# EasyEDA Pro project TES_Controller_V1.1.eprj

# Schematic Schematic1

## Sheets
1 P1: Board Name: Board1; Create Date: 2025-07-27; Page Name: P1; Project Name: TES_Controller_V1.1; Schematic Name: Schematic1; Update Date: 2025-08-24; Company: EasyEDA.com; Page Size: A4; Version: V1.0
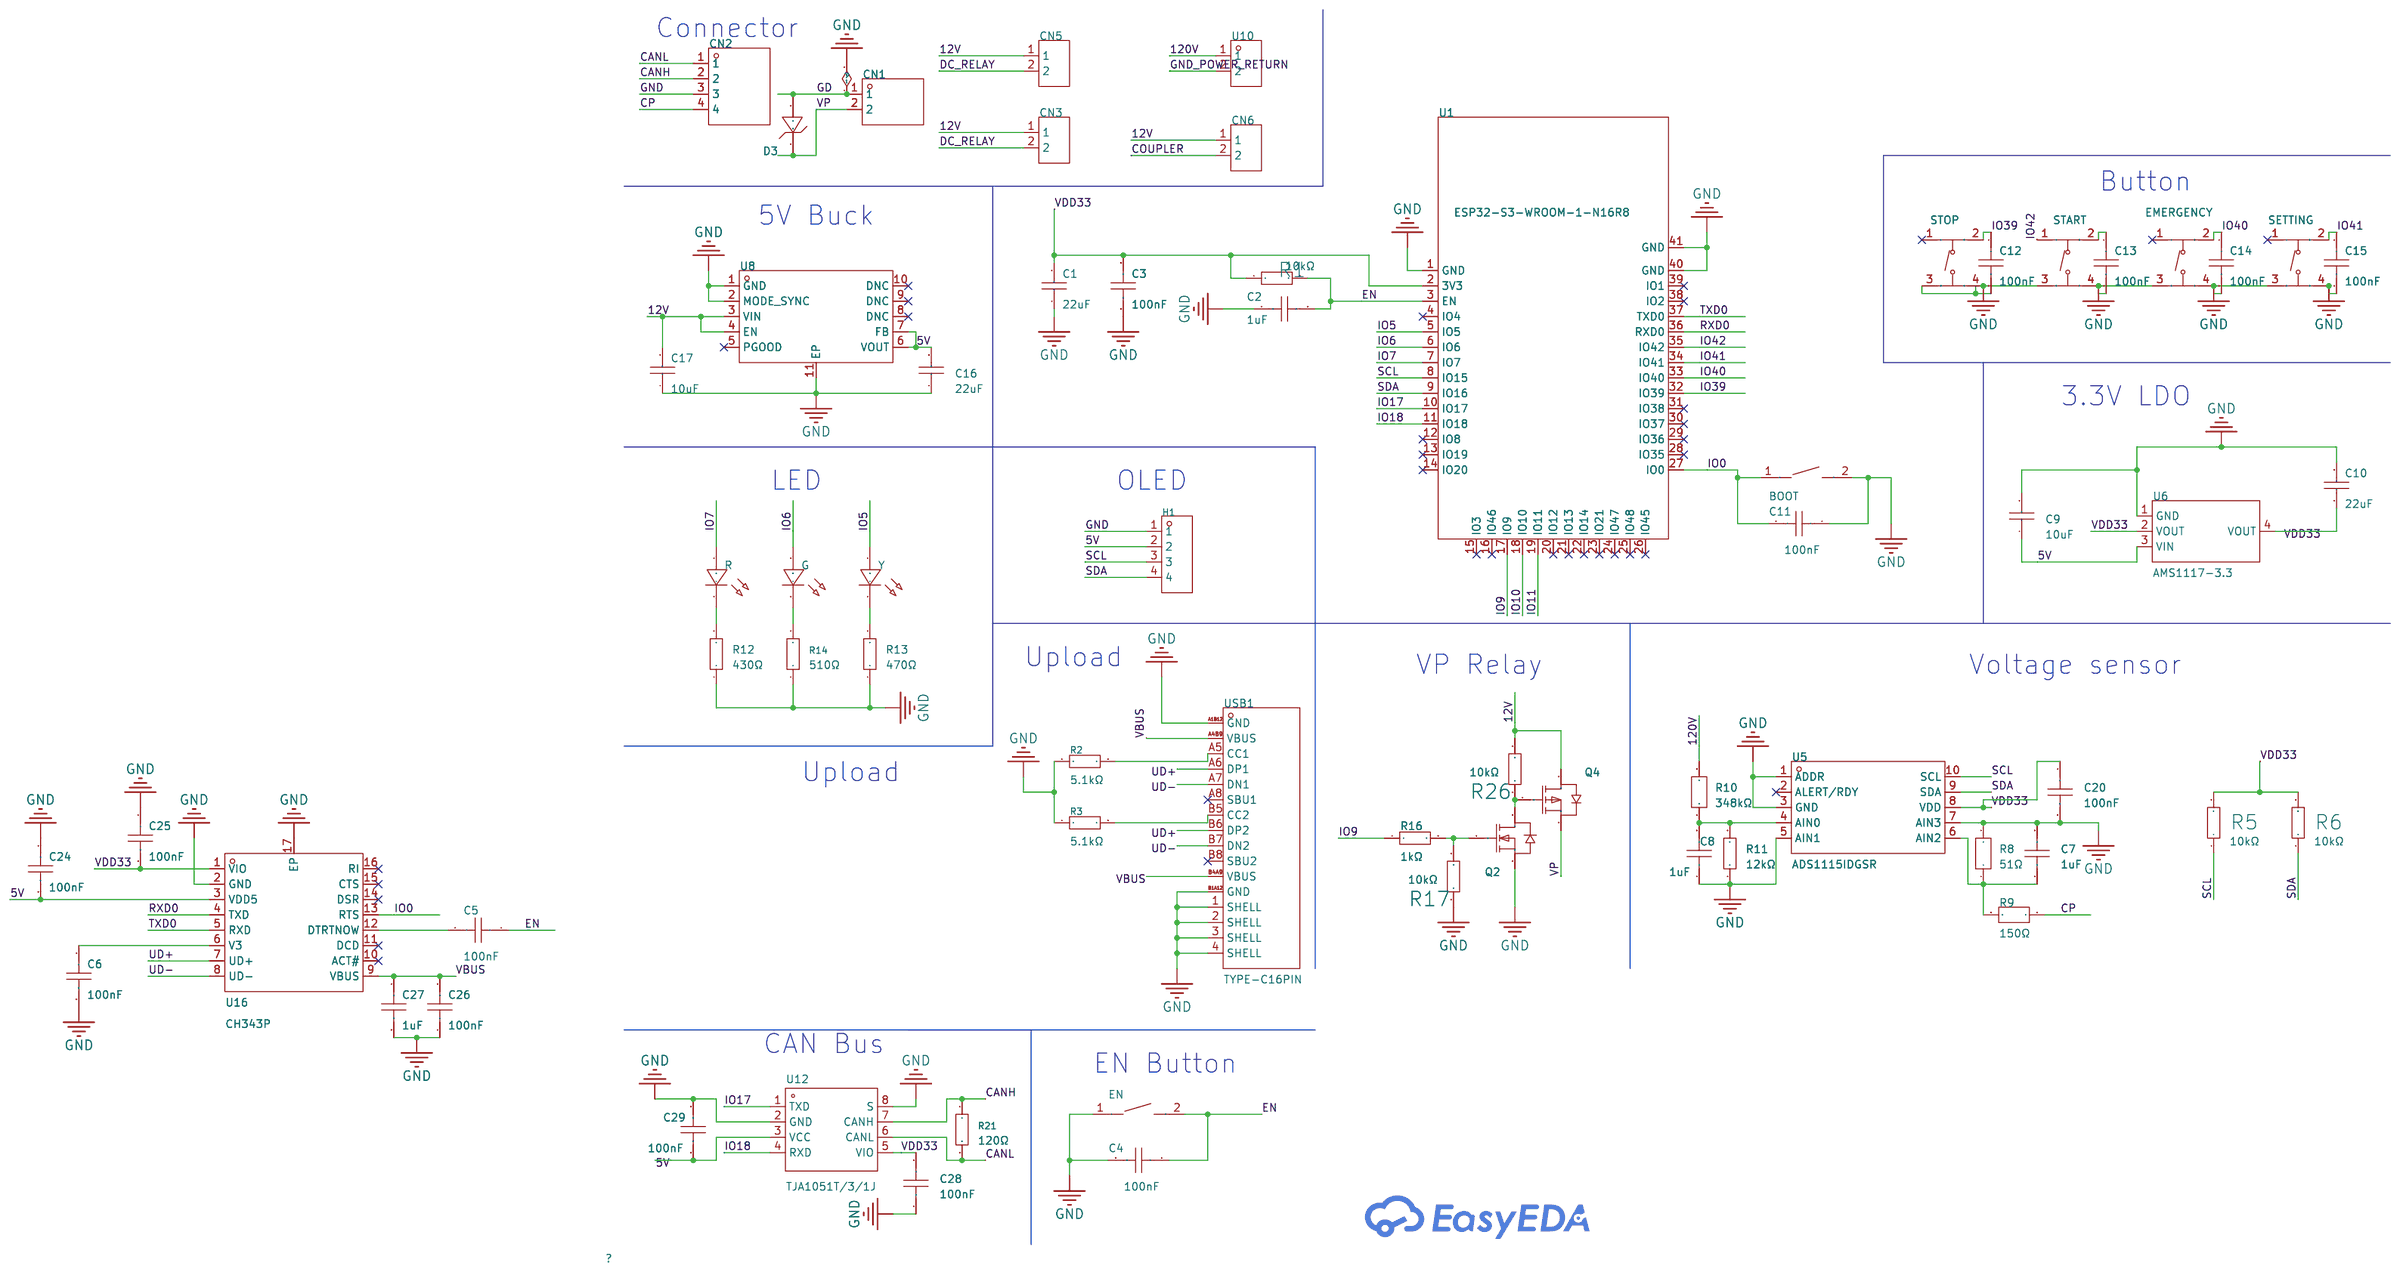
[diagram p0: P1]
2 P2: Create Date: 2025-08-19; Page Name: P2; Project Name: TES_Controller_V1; Update Date: 2025-08-19
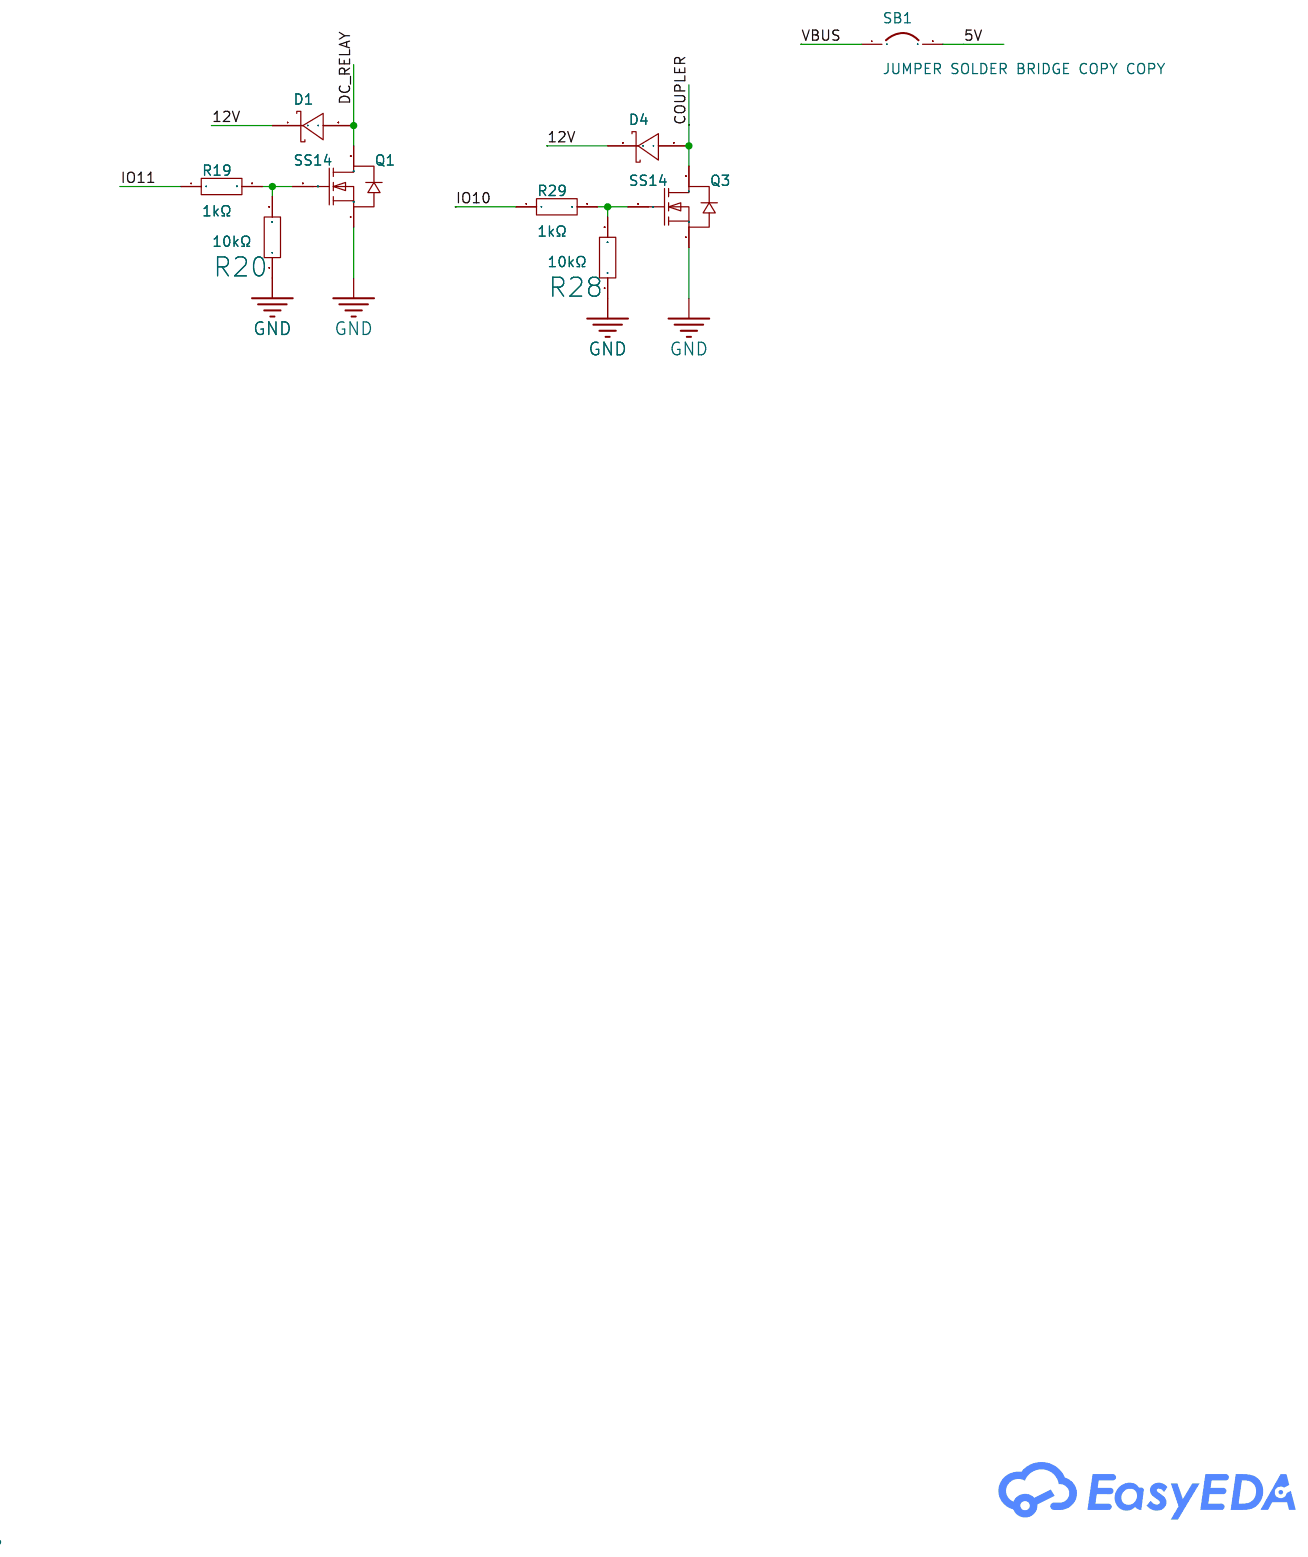
[diagram p1: P2]

## Parts
sheet P1
BOOT  TS-1088-AR02016  [SW-SMD_L3.9-W3.0-P4.45]
C1  22uF  [C1206]
C2  1uF  [C0603]
C3  100nF  [C0603]
C4  100nF  [C0603]
C5  100nF  [C0603]
C6  100nF  [C0603]
C7  1uF  [C0603]
C8  1uF  [C0603]
C9  10uF  [C1206]
C10  22uF  [C1206]
C11  100nF  [C0603]
C12  100nF  [C0603]
C13  100nF  [C0603]
C14  100nF  [C0603]
C15  100nF  [C0603]
C16  22uF  [C1206]
C17  10uF  [C1206]
C20  100nF  [C0603]
C24  100nF  [C0603]
C25  100nF  [C0603]
C26  100nF  [C0603]
C27  1uF  [C0603]
C28  100nF  [C0603]
C29  100nF  [C0603]
CN1  B2PS-VH(LF)(SN)  [CONN-TH_B2PS-VH-LF-SN]
CN2  S4B-XH-A(LF)(SN)  [CONN-TH_S4B-XH-A-LF-SN]
CN3  DG381-3.5-02P-14-00A(H)  [CONN-TH_2P-P3.50_DG381-3.5-02P-14-00A]
CN5  DG381-3.5-02P-14-00A(H)  [CONN-TH_2P-P3.50_DG381-3.5-02P-14-00A]
CN6  DG381-3.5-02P-14-00A(H)  [CONN-TH_2P-P3.50_DG381-3.5-02P-14-00A]
D3  SMBJ12A  [SMB_L4.6-W3.6-LS5.3-RD]
EMERGENCY  TS-1187A-B-A-B  [SW-SMD_4P-L5.1-W5.1-P3.70-LS6.5-TL_H1.5]
EN  TS-1088-AR02016  [SW-SMD_L3.9-W3.0-P4.45]
G  -  [LED-TH_BD5.8-P2.54-FD]  (no BOM)
H1  -  [HDR-TH_4P-P2.54-V-F]
Q2  AO3400A  [SOT-23-3_L2.9-W1.3-P1.90-LS2.4-BR]
Q4  AO3401A  [SOT-23_L2.9-W1.3-P1.90-LS2.4-BR]
R  -  [LED-TH_BD5.8-P2.54-FD]  (no BOM)
R1  10kΩ  [R0603]
R2  5.1kΩ  [R0402]
R3  5.1kΩ  [R0402]
R5  10kΩ  [R0603]
R6  10kΩ  [R0603]
R8  51Ω  [R1206]
R9  150Ω  [R1210]
R10  348kΩ  [R0603]
R11  12kΩ  [R0603]
R12  430Ω  [R0603]
R13  470Ω  [R0603]
R14  510Ω  [R0603]
R16  1kΩ  [R0603]
R17  10kΩ  [R0603]
R21  120Ω  [R0603]
R26  10kΩ  [R0603]
SETTING  TS-1187A-B-A-B  [SW-SMD_4P-L5.1-W5.1-P3.70-LS6.5-TL_H1.5]
START  TS-1187A-B-A-B  [SW-SMD_4P-L5.1-W5.1-P3.70-LS6.5-TL_H1.5]
STOP  TS-1187A-B-A-B  [SW-SMD_4P-L5.1-W5.1-P3.70-LS6.5-TL_H1.5]
U1  ESP32-S3-WROOM-1-N16R8  [WIRELM-SMD_ESP32-S3-WROOM-1]
U5  ADS1115IDGSR  [MSOP-10_L3.0-W3.0-P0.50-LS5.0-BL]
U6  AMS1117-3.3  [SOT-223-3_L6.5-W3.4-P2.30-LS7.0-BR]
U8  LMZM23601V5SILR  [USIP-10_L3.8-W3.0-TL_TI_SIL]
U10  DG301-5.0-02P-14-00A(H)  [CONN-TH_DEGSON_DG301-5.0-02P]
U12  TJA1051T/3/1J  [SOIC-8_L4.9-W3.9-P1.27-LS6.0-BL]
U16  CH343P  [TQFN-16_L3.0-W3.0-P0.50-BL-EP1.7]
USB1  TYPE-C16PIN  [USB-C-SMD_TYPE-C16PIN]
Y  -  [LED-TH_BD5.8-P2.54-FD]  (no BOM)
sheet P2
D1  SS14  [SMA_L4.2-W2.6-LS5.0-RD_1]
D4  SS14  [SMA_L4.2-W2.6-LS5.0-RD_1]
Q1  AO3400A  [SOT-23-3_L2.9-W1.3-P1.90-LS2.4-BR]
Q3  AO3400A  [SOT-23-3_L2.9-W1.3-P1.90-LS2.4-BR]
R19  1kΩ  [R0603]
R20  10kΩ  [R0603]
R28  10kΩ  [R0603]
R29  1kΩ  [R0603]
SB1  Jumper  [PAD-JUMPER-2-NC_BY_PASTE_YES_SILK]

## Library data of the parts
BOOT EN = TS-1088-AR02016: LCSC Part Name: 4*3*2mm 立贴 轻触开关; Supplier Part: C720477; Manufacturer: XUNPU(讯普); Supplier Footprint: SMD; Datasheet: https://atta.szlcsc.com/upload/public/pdf/source/20200810/C720475_60D09DD6C54279ADDB2DC25100F1CC11.pdf; Supplier: LCSC; Circuit: SPST; Actuator Style: Round Button; Operating Force: 160gf; Mounting Style: Brick nogging; Switch Length: 4mm; Switch Width: 3mm; Switch Height: 2mm; Strike Gundam: 不带; Contact Current: 50mA; Voltage Rating (DC): 12V; Insulation Resistance: 100MΩ; Actuator/Cap Color: Black; Pin Style: SMDSplicing; Mechanical Life: 10万次; Operating Temperature: -30℃~+80℃; Check: true
C1 C10 C16 = CL31A226KAHNNNE: LCSC Part Name: 22uF ±10% 25V; Supplier Part: C12891; Manufacturer: SAMSUNG(三星); Supplier Footprint: 1206; JLCPCB Part Class: 基础库; Datasheet: https://atta.szlcsc.com/upload/public/pdf/source/20160218/1457707763339.pdf; Supplier: LCSC; Tolerance: ±10%; Check: true
C2 C7 C8 C27 = CL10A105KB8NNNC: LCSC Part Name: 1uF ±10% 50V; Supplier Part: C15849; Manufacturer: SAMSUNG(三星); Supplier Footprint: 0603; JLCPCB Part Class: 基础库; Datasheet: https://atta.szlcsc.com/upload/public/pdf/source/20160218/1457707763339.pdf; Supplier: LCSC; Tolerance: ±10%; Check: true
C3-C6 C11-C15 C20 C24-C26 = CC0603KRX7R9BB104: LCSC Part Name: 100nF ±10% 50V; Supplier Part: C14663; Manufacturer: YAGEO(国巨); Supplier Footprint: 0603; JLCPCB Part Class: 基础库; Datasheet: https://atta.szlcsc.com/upload/public/pdf/source/20250214/096C4C206003071F5D32E5F0D8E7F8DF.pdf; Supplier: LCSC; Tolerance: ±10%; Voltage Rating: 50V; Temperature Coefficient: X7R; Check: true
C9 C17 = CL31A106KBHNNNE: LCSC Part Name: 10uF ±10% 50V; Supplier Part: C13585; Manufacturer: SAMSUNG(三星); Supplier Footprint: 1206; JLCPCB Part Class: 基础库; Datasheet: https://atta.szlcsc.com/upload/public/pdf/source/20160218/1457707763339.pdf; Supplier: LCSC; Tolerance: ±10%; Check: true
C28 C29 = CC0603KRX7R9BB104: LCSC Part Name: 100nF ±10% 50V; Supplier Part: C14663; Manufacturer: YAGEO(国巨); Supplier Footprint: 0603; JLCPCB Part Class: 基础库; Datasheet: https://atta.szlcsc.com/upload/public/pdf/source/20250214/096C4C206003071F5D32E5F0D8E7F8DF.pdf; Supplier: LCSC; Tolerance: ±10%; Voltage Rating: 50V; Temperature Coefficient: X7R
CN1 = B2PS-VH(LF)(SN): LCSC Part Name: 1x2P 间距:3.96mm 弯插 系列:VH; Supplier Part: C158007; Manufacturer: JST; Supplier Footprint: 弯插,P=3.96mm; Datasheet: https://atta.szlcsc.com/upload/public/pdf/source/20180807/C267111_104B2B82EF5D002133F5063D0D7C94AB.pdf; Supplier: LCSC; Pins Structure: 1x2P; Pitch: 3.96mm; Mounting Style: Bend insert; Reference Series: VH; Number of Pins: 2P; Number of Rows: 1; Number of PINs Per Row: 2; Current Rating (Max): 10A; Contact Material: Brass; Contact Plating: Tin; Operating Temperature Range: -25℃~+85℃; Rated Voltage (Max): 250V; Plastic Material: PA66; Flame Retardant Rating: UL94V-0; Colour: White; Z-Height of the Board: 8.5mm; X-Length of Bottom Edge on Board (Spacing Line): 7.86mm; Y-Width of Bottom Edge on Board: 14.9mm; Check: true
CN2 = S4B-XH-A(LF)(SN): LCSC Part Name: 1x4P 间距:2.5mm 弯插 系列:XH; Supplier Part: C157925; Manufacturer: JST; Supplier Footprint: 弯插,P=2.5mm; Datasheet: https://atta.szlcsc.com/upload/public/pdf/source/20180928/C265283_F9DFEEBDB2CF642B6BDFAB4B77BD2680.pdf; Supplier: LCSC; Pins Structure: 1x4P; Pitch: 2.5mm; Mounting Style: Bend insert; Reference Series: XH; Number of Pins: 4P; Number of Rows: 1; Number of PINs Per Row: 4; Current Rating (Max): 3A; Contact Material: Brass; Contact Plating: Tin; Operating Temperature Range: -25℃~+85℃; Rated Voltage (Max): 250V; Plastic Material: PA66; Flame Retardant Rating: UL94V-0; Supplementary Features: K-leg punch; Colour: White; Z-Height of the Board: 6.1mm; X-Length of Bottom Edge on Board (Spacing Line): 12.4mm; Y-Width of Bottom Edge on Board: 11.5mm; Check: true
CN3 CN5 CN6 = DG381-3.5-02P-14-00A(H): LCSC Part Name: 3.5mm 直插 排数:1 每排P数:2; Supplier Part: C5272864; Manufacturer: DEGSON(高正/高松); Supplier Footprint: 插件,P=3.5mm; Datasheet: https://atta.szlcsc.com/upload/public/pdf/source/20221116/069171FF23C61B982410A9A369C7D043.pdf; Supplier: LCSC; Pitch: 3.5mm; Mounting Type: Direct Insert; Number of Pins: 2P; Number of Rows: 1; Number of PINs Per Row: 2; Check: true
D3 = SMBJ12A_C908793: Polarity:Unidirectional Reverse Stand-Off Voltage (Vrwm):12V Clamping Voltage:19.9V Peak Pulse Current (Ipp):30.2A Peak Pulse Power Dissipation (Ppp):600W Voltage - Breakdown:13.3V Reverse Leakage Current (Ir):5uA Operating Temperature:-55℃~+150℃@(Tj) Ope; LCSC Part Name: 单向TVS 12V截止 30.2A峰值脉冲; Supplier Part: C908793; Manufacturer: GOODWORK(固得沃克); Supplier Footprint: DO-214AA(SMB); JLCPCB Part Class: 扩展库; Datasheet: https://item.szlcsc.com/datasheet/SMBJ12A/975545.html; Supplier: LCSC; Polarity: Unidirectional; Reverse Stand-Off Voltage (Vrwm): 12V; Clamping Voltage: 19.9V; Peak Pulse Current (Ipp): 30.2A; Peak Pulse Power Dissipation (Ppp): 600W; Voltage - Breakdown: 13.3V; Reverse Leakage Current (Ir): 5uA; Operating Temperature: -55℃~+150℃@(Tj); Type: TVS
EMERGENCY SETTING START STOP = TS-1187A-B-A-B: LCSC Part Name: 5.1*5.1*1.5mm 立贴 轻触开关; Supplier Part: C318884; Manufacturer: XKB Connectivity(中国星坤); Supplier Footprint: SMD; JLCPCB Part Class: 基础库; Datasheet: https://atta.szlcsc.com/upload/public/pdf/source/20200227/C318890_053E50208A88A7BA1965D8746000774E.pdf; Supplier: LCSC; Circuit: SPST; Actuator Style: Round Button; Operating Force: 160gf; Mounting Style: Brick nogging; Switch Length: 5.1mm; Switch Width: 5.1mm; Switch Height: 1.5mm; Strike Gundam: 不带; Contact Current: 50mA; Voltage Rating (DC): 12V; Actuator/Cap Color: 金色; With Lamp: No; Mechanical Life: 10万次; Operating Temperature: -30℃~+85℃; Check: true
G R Y = LED_TH-R_5mm: Supplier Footprint: Through
H1 = HDR-F_2.54_1x4P: Supplier Footprint: Through; Check: true
Q1-Q3 = AO3400A_C20917: Type:1 N-Channel Drain Source Voltage (Vdss): Continuous Drain Current (Id): Drain Source On Resistance (RDS(on)@Vgs,Id):26.5mΩ@10V,5.7A Power Dissipation (Pd): Gate Threshold Voltage (Vgs(th)@Id):1.5V@250uA Total Gate Charge (Qg@Vgs):7nC@4.5V Input Capac; LCSC Part Name: 1个N沟道 耐压:30V 电流:5.7A; Supplier Part: C20917; Manufacturer: AOS; Supplier Footprint: SOT-23-3L; JLCPCB Part Class: Basic Part; Datasheet: https://atta.szlcsc.com/upload/public/pdf/source/20140107/1457706668533.pdf; Supplier: LCSC; Type: 1 N-Channel; Drain Source On Resistance (RDS(on)@Vgs,Id): 26.5mΩ@10V,5.7A; Gate Threshold Voltage (Vgs(th)@Id): 1.5V@250uA; Total Gate Charge (Qg@Vgs): 7nC@4.5V; Input Capacitance (Ciss@Vds): 630pF@15V; Operating Temperature: -55℃~+150℃@(Tj)
Q4 = AO3401A_C15127: Number:1 P-Channel Drain to Source Voltage:30V Current - Continuous Drain(Id):4A RDS(on):47mΩ@10V；85mΩ@2.5V；60mΩ@4.5V Pd - Power Dissipation:- Gate Threshold Voltage (Vgs(th)):900mV@250uA Gate Charge(Qg):14nC@10V Input Capacitance(Ciss):645pF Reverse Tran; LCSC Part Name: 1个P沟道 耐压:30V 电流:4A; Supplier Part: C15127; Manufacturer: AOS; Supplier Footprint: SOT-23; JLCPCB Part Class: 基础库; Datasheet: https://item.szlcsc.com/datasheet/AO3401A/15801.html; Supplier: LCSC; Number: 1 P-Channel; Drain to Source Voltage: 30V; Current - Continuous Drain(Id): 4A; RDS(on): 47mΩ@10V；85mΩ@2.5V；60mΩ@4.5V; Gate Threshold Voltage (Vgs(th)): 900mV@250uA; Gate Charge(Qg): 14nC@10V; Input Capacitance(Ciss): 645pF; Reverse Transfer Capacitance (Crss@Vds): 55pF; Output Capacitance(Coss): 80pF
R1 R5 R6 R17 R20 R26 R28 = 0603WAF1002T5E: LCSC Part Name: 厚膜电阻 10kΩ ±1% 100mW; Supplier Part: C25804; Manufacturer: UNI-ROYAL(厚声); Supplier Footprint: 0603; JLCPCB Part Class: 基础库; Datasheet: https://atta.szlcsc.com/upload/public/pdf/source/20200306/C422600_1E6D84923E4A46A82E41ADD87F860B5C.pdf; Supplier: LCSC; Type: Thick Film Resistor; Tolerance: ±1%; Power(Watts): 100mW; Voltage-Supply(Max): 75V; Temperature Coefficient: ±100ppm/℃; Operating Temperature: -55℃~+155℃; Check: true
R2 R3 = 0402WGF5101TCE: LCSC Part Name: 5.1kΩ ±1% 62.5mW 厚膜电阻; Supplier Part: C25905; Manufacturer: UNI-ROYAL(厚声); Supplier Footprint: 0402; Datasheet: https://atta.szlcsc.com/upload/public/pdf/source/20200306/C422600_1E6D84923E4A46A82E41ADD87F860B5C.pdf; Supplier: LCSC; Type: Thick Film Resistors; Tolerance: ±1%; Temperature Coefficient: ±100ppm/℃; Operating Temperature Range: -55℃~+155℃; Check: true
R8 = FRP1206F51R0TS: LCSC Part Name: 厚膜电阻 51Ω ±1% 500mW; Supplier Part: C7468320; Manufacturer: FOJAN(富捷); Supplier Footprint: 1206; JLCPCB Part Class: 扩展库; Datasheet: https://atta.szlcsc.com/upload/public/pdf/source/20230915/D88BDA77B27A9698C44CA869125B965F.pdf; Supplier: LCSC; Type: Thick Film Resistor; Tolerance: ±1%; Power(Watts): 500mW; Temperature Coefficient: ±200ppm/℃; Check: true
R9 = FRC1210F1500TS: LCSC Part Name: 厚膜电阻 150Ω ±1% 500mW; Supplier Part: C2933805; Manufacturer: FOJAN(富捷); Supplier Footprint: 1210; Datasheet: https://atta.szlcsc.com/upload/public/pdf/source/20240815/E4F1531D1C60085E6B84901F2C57F42A.pdf; Supplier: LCSC; Type: Thick Film Resistors; Tolerance: ±1%; Temperature Coefficient: ±100ppm/℃; Operating Temperature Range: -55℃~+155℃; Check: true
R10 = RT0603BRD07348KL: LCSC Part Name: 薄膜电阻 348kΩ ±0.1% 100mW; Supplier Part: C861336; Manufacturer: YAGEO(国巨); Supplier Footprint: 0603; Datasheet: https://item.szlcsc.com/datasheet/RT0603BRD07348KL/921674.html; Supplier: LCSC; Type: Thin Film Resistor; Tolerance: ±0.1%; Power(Watts): 100mW; Temperature Coefficient: ±25ppm/℃; Operating Temperature: -55℃~+155℃
R11 = RT0603BRD0712KL: LCSC Part Name: 薄膜电阻 12kΩ ±0.1% 100mW; Supplier Part: C326735; Manufacturer: YAGEO(国巨); Supplier Footprint: 0603; JLCPCB Part Class: 扩展库; Datasheet: https://atta.szlcsc.com/upload/public/pdf/source/20181031/C326735_4104B15733CB2D0B2F5DDB60451654E8.pdf; Supplier: LCSC; Type: Thin Film Resistor; Tolerance: ±0.1%; Temperature Coefficient: ±25ppm/℃; Operating Temperature Range: -55℃~+155℃; Check: true
R12 = RC0603FR-07430RL: LCSC Part Name: 厚膜电阻 430Ω ±1% 100mW; Supplier Part: C137721; Manufacturer: YAGEO(国巨); Supplier Footprint: 0603; JLCPCB Part Class: 扩展库; Datasheet: https://atta.szlcsc.com/upload/public/pdf/source/20180821/C275644_0D56F95EFF785E7D9A1FEF436B37DA78.pdf; Supplier: LCSC; Type: Thick Film Resistors; Tolerance: ±1%; Temperature Coefficient: ±100ppm/℃; Operating Temperature Range: -55℃~+155℃; Check: true
R13 = 0603WAF4700T5E: LCSC Part Name: 470Ω ±1% 100mW 厚膜电阻; Supplier Part: C23179; Manufacturer: UNI-ROYAL(厚声); Supplier Footprint: 0603; JLCPCB Part Class: 基础库; Datasheet: https://atta.szlcsc.com/upload/public/pdf/source/20200306/C422600_1E6D84923E4A46A82E41ADD87F860B5C.pdf; Supplier: LCSC; Type: Thick Film Resistors; Tolerance: ±1%; Temperature Coefficient: ±100ppm/℃; Operating Temperature Range: -55℃~+155℃; Check: true
R14 = 0603WAF5100T5E: LCSC Part Name: 510Ω ±1% 100mW 厚膜电阻; Supplier Part: C23193; Manufacturer: UNI-ROYAL(厚声); Supplier Footprint: 0603; Datasheet: https://atta.szlcsc.com/upload/public/pdf/source/20200306/C422600_1E6D84923E4A46A82E41ADD87F860B5C.pdf; Supplier: LCSC; Type: Thick Film Resistors; Tolerance: ±1%; Temperature Coefficient: ±100ppm/℃; Operating Temperature Range: -55℃~+155℃; Check: true
R16 R19 R29 = 0603WAF1001T5E: LCSC Part Name: 1kΩ ±1% 100mW 厚膜电阻; Supplier Part: C21190; Manufacturer: UNI-ROYAL(厚声); Supplier Footprint: 0603; JLCPCB Part Class: 基础库; Datasheet: https://atta.szlcsc.com/upload/public/pdf/source/20200306/C422600_1E6D84923E4A46A82E41ADD87F860B5C.pdf; Supplier: LCSC; Type: Thick Film Resistors; Tolerance: ±1%; Temperature Coefficient: ±100ppm/℃; Operating Temperature Range: -55℃~+155℃; Check: true
R21 = 0603WAF1200T5E: LCSC Part Name: 120Ω ±1% 100mW 厚膜电阻; Supplier Part: C22787; Manufacturer: UNI-ROYAL(厚声); Supplier Footprint: 0603; JLCPCB Part Class: 基础库; Datasheet: https://atta.szlcsc.com/upload/public/pdf/source/20200306/C422600_1E6D84923E4A46A82E41ADD87F860B5C.pdf; Supplier: LCSC; Type: Thick Film Resistors; Tolerance: ±1%; Temperature Coefficient: ±100ppm/℃; Operating Temperature Range: -55℃~+155℃
U1 = ESP32-S3-WROOM-1-N16R8: LCSC Part Name: 通用型Wi-Fi+低功耗蓝牙MCU模组; Supplier Part: C2913202; Manufacturer: ESPRESSIF(乐鑫); Supplier Footprint: SMD,18x25.5mm; JLCPCB Part Class: 扩展库; Datasheet: https://atta.szlcsc.com/upload/public/pdf/source/20241030/6A412B13087E1327DF6279F5735253CA.pdf; Supplier: LCSC; Check: true
U5 = ADS1115IDGSR: LCSC Part Name: 具有内部基准、振荡器和可编程比较器且兼容 I2C 的ADS111x、超小型、低功耗 860SPS、16位ADC; Supplier Part: C37593; Manufacturer: TI(德州仪器); Supplier Footprint: VSSOP-10; JLCPCB Part Class: 扩展库; Datasheet: https://www.ti.com/cn/lit/gpn/ads1115; Supplier: LCSC; Resolution(Bits): 16Bit; number of channels: 4; Voltage - Supply: 2V~5.5V; Interface: I2C; Integral non - linearity: 1LSB; Operating Temperature: -40℃~+125℃; Check: true
U6 = AMS1117-3.3_C6186: LCSC Part Name: 输出3.3V 1A; Supplier Part: C6186; Manufacturer: AMS; Supplier Footprint: SOT-223; JLCPCB Part Class: 基础库; Datasheet: https://atta.szlcsc.com/upload/public/pdf/source/20180727/C6186_7A095716F0823C02F1997A905E26C086.pdf; Supplier: LCSC; Output Type: Fixed; Voltage - Supply: 16V; Output Voltage: 3.3V; Output Current: 1A; Power Supply Rejection Ratio (PSRR): 72dB@(120Hz); Voltage Dropout: 1.1V@(800mA); standby current: 5mA; Features: Over Current Protection；Over Temperature Protection; Operating Temperature: -40℃~+125℃; Output Configuration: Positive; Number of Outputs: 1; Check: true
U8 = LMZM23601V5SILR: Supplier Part: C2868357; Manufacturer: TI(德州仪器); Supplier Footprint: USIP-10; JLCPCB Part Class: 扩展库; Datasheet: https://www.ti.com/cn/lit/gpn/lmzm23601; Supplier: LCSC; Input Voltage(DC): 4V~36V; Output Voltage: 5V; Output Current (Max): 1A; Output Channel: 1; Conversion Efficiency: 87%; Check: true
U10 = DG301-5.0-02P-14-00A(H): LCSC Part Name: 5mm 直插 排数:1 每排P数:2; Supplier Part: C5128812; Manufacturer: DEGSON(高正/高松); Supplier Footprint: 插件,P=5mm; Datasheet: https://atta.szlcsc.com/upload/public/pdf/source/20220616/FBEDEC35C713F5559304A8F5E5617E2B.pdf; Supplier: LCSC; Pitch: 5mm; Mounting Style: Direct Insert; Number of Pins: 2P; Number of Rows: 1; Number of PINs Per Row: 2; Check: true
U12 = TJA1051T/3/1J: Supplier Part: C38695; Manufacturer: NXP(恩智浦); Supplier Footprint: SOIC-8-150mil; JLCPCB Part Class: 扩展库; Datasheet: https://www.nxp.com/docs/en/data-sheet/TJA1051.pdf; Supplier: LCSC; Data Rate: 5Mbps; Supply Voltage: 4.5V~5.5V; Supply Current: 5mA; Operating Temperature: -40℃~+150℃
U16 = CH343P: Supplier Part: C2846043; Manufacturer: WCH(南京沁恒); Supplier Footprint: TQFN-16-EP(3x3); JLCPCB Part Class: 扩展库; Datasheet: https://atta.szlcsc.com/upload/public/pdf/source/20211010/C2846043_7FA705E1F14A2906F6A2AFA45FA28209.pdf; Supplier: LCSC; Applications Function: USB to UART; USB Protocol: USB 2.0; Voltage - Supply: 3.3V；5V; Data Rate: 6Mbps; Operating Temperature: -40℃~+85℃
USB1 = TYPE-C16PIN: LCSC Part Name: Type-C 母 卧贴; Supplier Part: C393939; Manufacturer: SHOU HAN(首韩); Supplier Footprint: SMD; JLCPCB Part Class: 扩展库; Datasheet: https://atta.szlcsc.com/upload/public/pdf/source/20250618/9FBF2A26CFCE0E69298FA0B726710E9E.pdf; Supplier: LCSC; Connector Type: Type-C; Protocol Standard: USB 3.1; Gender: Female; Mounting Type: Surface Mount, Right Angle; Number of Contacts: 16P; Number of Ports: 1; Current Rating-Power: 3A; Voltage Rating: 30V; Connect-Disconnect Life: 10,000 Cycles; Detection color: Black; Operating Temperature: -40℃~+85℃; Check: true
D1 D4 = SS14_C2480: LCSC Part Name: 电压:40V 电流:1A; Supplier Part: C2480; Manufacturer: MDD(辰达半导体); Supplier Footprint: SMA(DO-214AC); JLCPCB Part Class: 基础库; Datasheet: https://atta.szlcsc.com/upload/public/pdf/source/20241121/B157EB417161760A7ED23035C0FAAB28.pdf; Supplier: LCSC; Diode Configuration: Independent; Voltage - Forward(Vf@If): 550mV@1A; Voltage - DC Reverse(Vr): 40V; Current - Rectified: 1A; Reverse Leakage Current (Ir): 300uA@40V; Check: true
SB1 = JUMPER SOLDER BRIDGE COPY COPY: Supplier: LCSC; Supplier Part: C21189; Manufacturer: NONE; Manufacturer Part: 0603WAF0000T5E; Check: false

## Nets
5V: C9.1 C16.2 C24.2 C29.1 H1.2 SB1.2 U6.3(VIN) U8.6(VOUT) U8.7(FB) U12.3(VCC) U16.3(VDD5)
12V: C17.2 CN3.1 CN5.1 CN6.1 D1.1(K) D4.1(K) Q4.3(D) R26.2 U8.3(VIN) U8.4(EN)
120V: R10.2 U10.1
GND: BOOT.2 C1.1 C2.1 C3.1 C4.2 C6.2 C7.2 C8.1 C9.2 C10.2 C11.1 C12.2 C13.2 C14.2 C15.2 C16.1 C17.1 C20.2 C24.1 C25.1 C26.1 C27.2 C28.1 C29.2 CN1.1 CN2.3 D3.2(A) EMERGENCY.3(C) EMERGENCY.4(D) EN.1 H1.1 Q1.1(S) Q2.1(S) Q3.1(S) R2.1 R3.1 R8.2 R11.1 R12.1 R13.1 R14.1 R17.1 R20.1 R28.1 SETTING.3(C) SETTING.4(D) START.3(C) START.4(D) STOP.3(C) STOP.4(D) U1.1(GND) U1.40(GND) U1.41(GND) U5.1(ADDR) U5.3(GND) U5.5(AIN1) U5.7(AIN3) U6.1(GND) U8.1(GND) U8.2(MODE_SYNC) U8.11(EP) U12.2(GND) U12.8(S) U16.2(GND) U16.17(EP) USB1.1(SHELL) USB1.2(SHELL) USB1.3(SHELL) USB1.4(SHELL) USB1.A1B12(GND) USB1.B1A12(GND)
GND_POWER_RETURN: U10.2
VBUS: C26.2 C27.1 SB1.1 U16.9(VBUS) USB1.A4B9(VBUS) USB1.B4A9(VBUS)
VDD33: C1.2 C3.2 C10.1 C20.1 C25.2 C28.2 R1.1 R5.2 R6.2 U1.2(3V3) U5.8(VDD) U6.2(VOUT) U6.4(VOUT) U12.5(VIO) U16.1(VIO)
CANH: CN2.2 R21.1 U12.7(CANH)
CANL: CN2.1 R21.2 U12.6(CANL)
COUPLER: CN6.2 D4.2(A) Q3.3(D)
CP: CN2.4 R9.1
DC_RELAY: CN3.2 CN5.2 D1.2(A) Q1.3(D)
EN: C2.2 C4.1 C5.1 EN.2 R1.2 U1.3(EN)
IO0: BOOT.1 C11.2 U1.27(IO0) U16.13(RTS)
IO5: U1.5(IO5) Y.1(C)
IO6: G.1(C) U1.6(IO6)
IO7: R.1(C) U1.7(IO7)
IO9: R16.1 U1.17(IO9)
IO10: R29.1 U1.18(IO10)
IO11: R19.1 U1.19(IO11)
IO17: U1.10(IO17) U12.1(TXD)
IO18: U1.11(IO18) U12.4(RXD)
IO39: C12.1 STOP.2(B) U1.32(IO39)
IO40: C14.1 EMERGENCY.2(B) U1.33(IO40)
IO41: C15.1 SETTING.2(B) U1.34(IO41)
IO42: START.1(A) U1.35(IO42)
RXD0: U1.36(RXD0) U16.4(TXD)
SCL: H1.3 R5.1 U1.8(IO15) U5.10(SCL)
SDA: H1.4 R6.1 U1.9(IO16) U5.9(SDA)
TXD0: U1.37(TXD0) U16.5(RXD)
UD+: U16.7(UD+) USB1.A6(DP1) USB1.B6(DP2)
UD-: U16.8(UD-) USB1.A7(DN1) USB1.B7(DN2)
VP: CN1.2 D3.1(C) Q4.2(S)
$1N24268: R13.2 Y.2(A)
$1N24269: G.2(A) R14.2
$1N24273: R.2(A) R12.2
$1N24295: R2.2 USB1.A5(CC1)
$1N24313: C7.1 R8.1 R9.2 U5.6(AIN2)
$1N24345: C8.2 R10.1 R11.2 U5.4(AIN0)
$1N24347: Q2.3(D) Q4.1(G) R26.1
$1N24383: C13.1 START.2(B)
$1N24441: Q2.2(G) R16.2 R17.2
$1N24443: R3.2 USB1.B5(CC2)
$1N24451: C5.2 U16.12(DTRTNOW)
$1N24463: C6.1 U16.6(V3)
$3N445: Q1.2(G) R19.2 R20.2
$3N451: Q3.2(G) R28.2 R29.2

Not connected (* = marked no-connect by the designer): EMERGENCY 1(A)*; SETTING 1(A)*; STOP 1(A)*; U1 4(IO4)* 12(IO8)* 13(IO19)* 14(IO20)* 15(IO3)* 16(IO46)* 20(IO12)* 21(IO13)* 22(IO14)* 23(IO21)* 24(IO47)* 25(IO48)* 26(IO45)* 28(IO35)* 29(IO36)* 30(IO37)* 31(IO38)* 38(IO2)* 39(IO1)*; U5 2(ALERT/RDY)*; U8 5(PGOOD)* 8(DNC)* 9(DNC)* 10(DNC)*; U16 10(ACT#)* 11(DCD)* 14(DSR)* 15(CTS)* 16(RI)*; USB1 A8(SBU1)* B8(SBU2)*

## Notes on the sheets
sheet 1
- Connector
- Button
- 5V Buck
- 3.3V LDO
- LED
- OLED
- Upload
- VP Relay
- Voltage sensor
- Upload
- CAN Bus
- EN Button

# Board PCB1
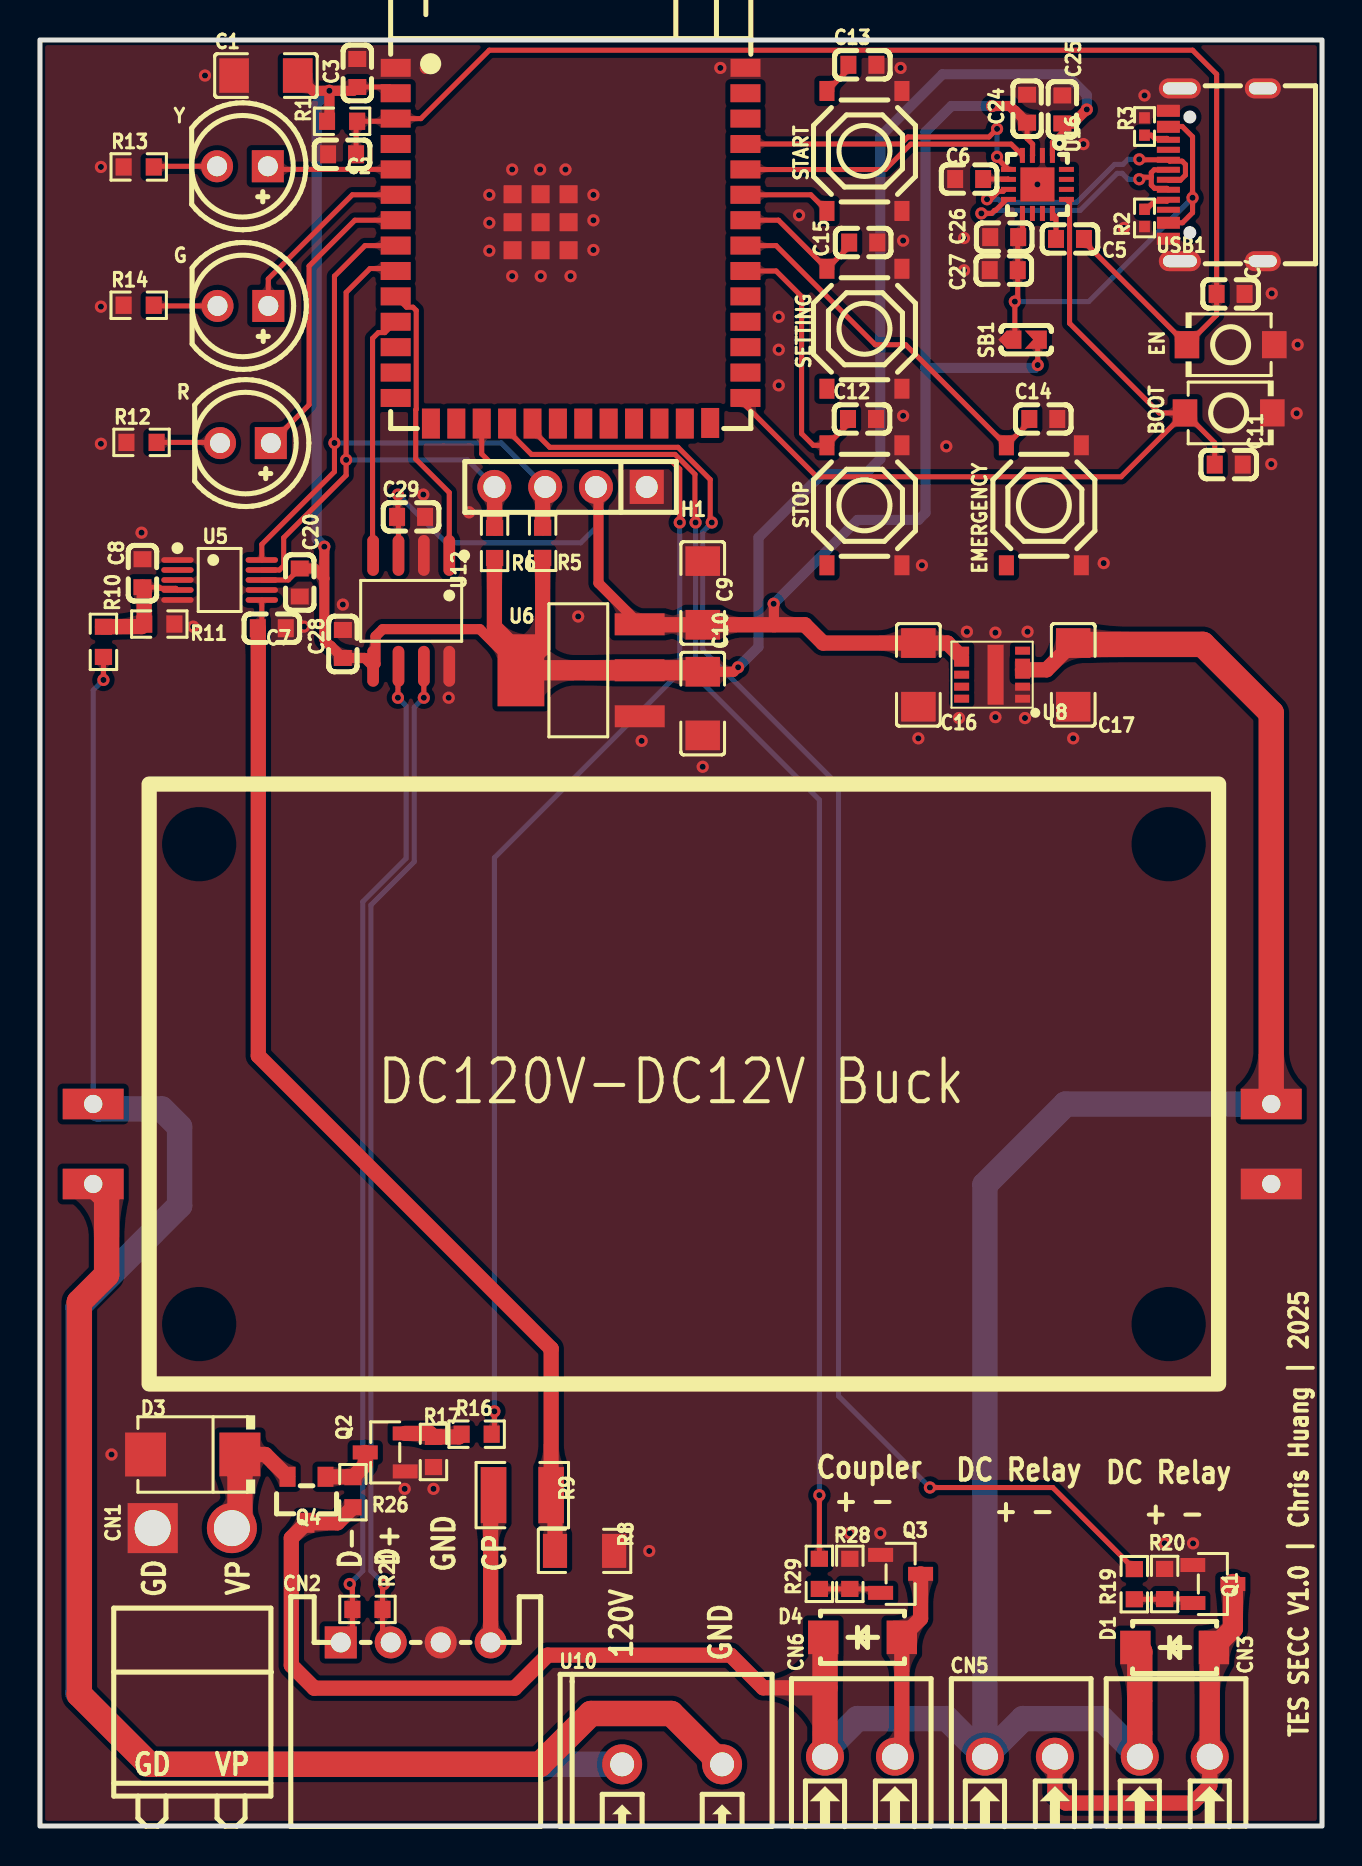
[diagram p2: board, top side]
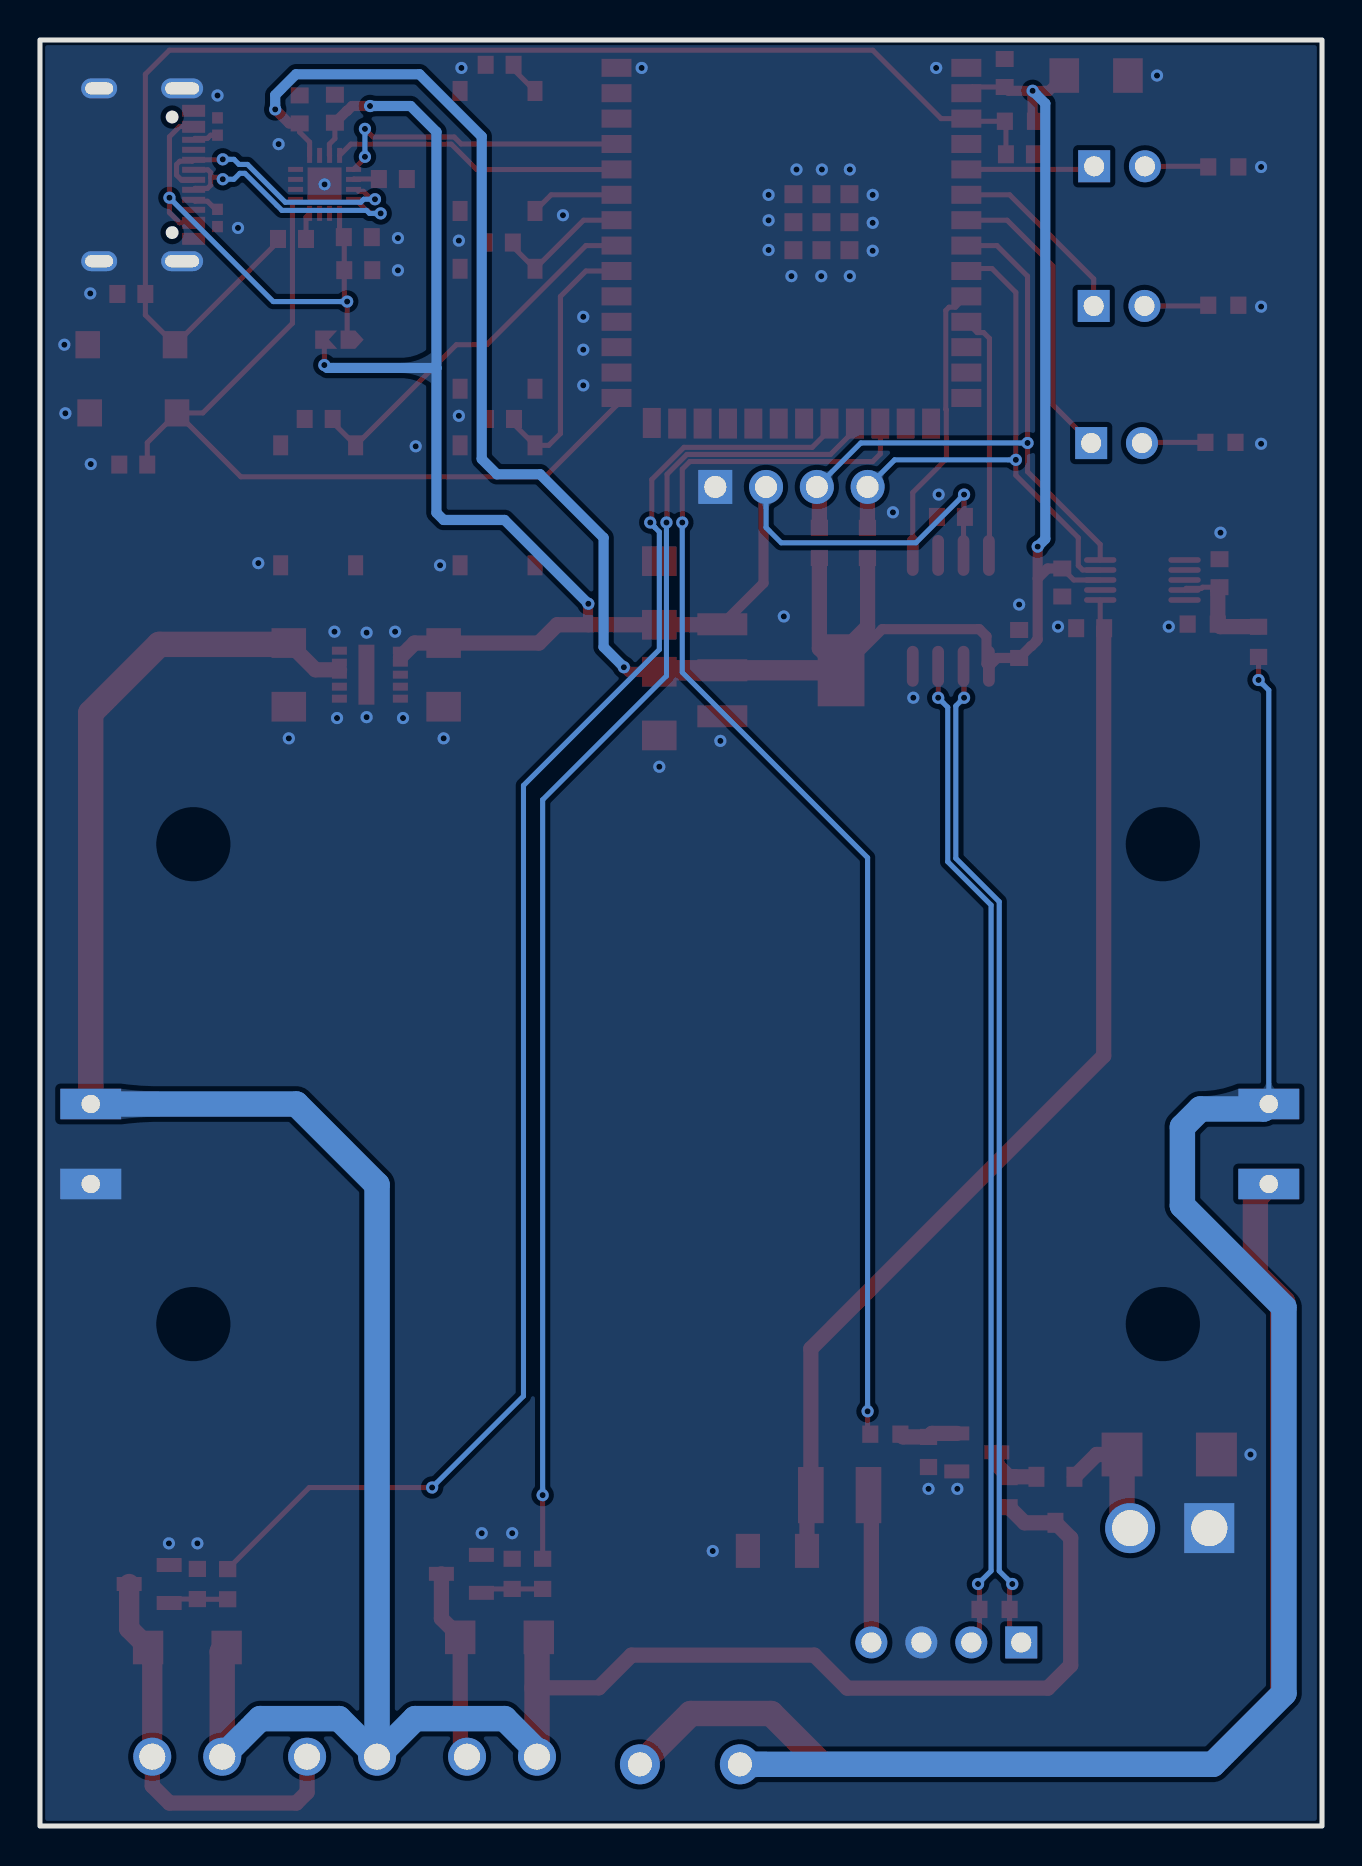
[diagram p3: board, bottom side, seen from below]

Outline 64.13 x 89.32 mm; copper layers: Top Layer, Bottom Layer. Coordinates in mm from the lower left corner of the outline.
Outline path: rectangle 0,89.32 64.13,0
Stack: Top Layer 0.035mm / Dielectric1 1.51mm FR4 er 4.5 / Bottom Layer 0.035mm

## Design rules (mm)
net CANL: DP2
net CANH: DP2
net UD+: DP1
net UD-: DP1
template: 自定义配置
spacing copperThickness1oz (default): track to track 0.102, other pairs 0.152 to 0.3
spacing copperThickness2oz: track to track 0.203, other pairs 0.152 to 0.3
track width copperThickness1oz (default): min 0.127, default 0.254, max 2.54
track width copperThickness2oz: min 0.203, default 0.254, max 2.54
differential pair differentialPair (default): width min 0.127, default 0.254, max 2.54; gap min 0.152, default 0.152
via viaSize (default): diameter min 0.5, default 0.61, max 10; hole min 0.3, default 0.305, max 6.3

## Placement (name value [footprint] x y rotation side)
BOOT  TS-1088-AR02016  [SW-SMD_L3.9-W3.0-P4.45]  59.46 70.67 0 top
C1  22uF  [C1206]  11.3 87.54 0 top
C2  1uF  [C0603]  15.11 83.6 0 top
C3  100nF  [C0603]  15.88 87.67 270 top
C4  100nF  [C0603]  59.56 76.62 0 top
C5  100nF  [C0603]  51.53 79.37 180 top
C6  100nF  [C0603]  46.48 82.36 180 top
C7  1uF  [C0603]  11.6 59.9 0 top
C8  1uF  [C0603]  5.13 62.65 270 top
C9  10uF  [C1206]  33.15 61.67 90 top
C10  22uF  [C1206]  33.15 56.13 270 top
C11  100nF  [C0603]  59.47 68.08 180 top
C12  100nF  [C0603]  41.12 70.37 0 top
C13  100nF  [C0603]  41.14 88.08 0 top
C14  100nF  [C0603]  50.19 70.37 0 top
C15  100nF  [C0603]  41.18 79.19 0 top
C16  22uF  [C1206]  43.94 57.57 90 top
C17  10uF  [C1206]  51.69 57.57 90 top
C20  100nF  [C0603]  13 62.19 270 top
C24  100nF  [C0603]  49.38 85.88 270 top
C25  100nF  [C0603]  51.15 85.85 270 top
C26  100nF  [C0603]  48.24 79.46 0 top
C27  1uF  [C0603]  48.21 77.81 180 top
C28  100nF  [C0603]  15.15 59.11 270 top
C29  100nF  [C0603]  18.56 65.47 0 top
CN1  B2PS-VH(LF)(SN)  [CONN-TH_B2PS-VH-LF-SN]  7.62 14.9 0 top
CN2  S4B-XH-A(LF)(SN)  [CONN-TH_S4B-XH-A-LF-SN]  18.8 9.18 180 top
CN3  DG381-3.5-02P-14-00A(H)  [CONN-TH_2P-P3.50_DG381-3.5-02P-14-00A]  56.77 3.47 0 top
CN5  DG381-3.5-02P-14-00A(H)  [CONN-TH_2P-P3.50_DG381-3.5-02P-14-00A]  49.02 3.47 0 top
CN6  DG381-3.5-02P-14-00A(H)  [CONN-TH_2P-P3.50_DG381-3.5-02P-14-00A]  41.02 3.47 0 top
D1  SS14  [SMA_L4.2-W2.6-LS5.0-RD_1]  56.76 8.93 0 top
D3  SMBJ12A  [SMB_L4.6-W3.6-LS5.3-RD]  7.64 18.58 180 top
D4  SS14  [SMA_L4.2-W2.6-LS5.0-RD_1]  41.15 9.44 0 top
EMERGENCY  TS-1187A-B-A-B  [SW-SMD_4P-L5.1-W5.1-P3.70-LS6.5-TL_H1.5]  50.22 66.05 90 top
EN  TS-1088-AR02016  [SW-SMD_L3.9-W3.0-P4.45]  59.56 74.08 180 top
G  -  [LED-TH_BD5.8-P2.54-FD]  10.15 76.02 180 top
H1  -  [HDR-TH_4P-P2.54-V-F]  26.54 66.97 180 top
NOREF  -  [Pad_e125]  61.59 32.11 0 top
NOREF#2  -  [Pad_e146]  2.66 36.11 0 top
NOREF#3  -  [Pad_e128]  61.59 36.11 0 top
NOREF#4  -  [Pad_e150]  2.66 32.11 0 top
Q1  AO3400A  [SOT-23-3_L2.9-W1.3-P1.90-LS2.4-BR]  58.67 12.1 180 top
Q2  AO3400A  [SOT-23-3_L2.9-W1.3-P1.90-LS2.4-BR]  17.27 18.68 0 top
Q3  AO3400A  [SOT-23-3_L2.9-W1.3-P1.90-LS2.4-BR]  43.05 12.61 180 top
Q4  AO3401A  [SOT-23_L2.9-W1.3-P1.90-LS2.4-BR]  13.34 16.31 90 top
R  -  [LED-TH_BD5.8-P2.54-FD]  10.28 69.16 180 top
R1  10kΩ  [R0603]  15.11 85.25 0 top
R2  5.1kΩ  [R0402]  55.25 80.42 90 top
R3  5.1kΩ  [R0402]  55.25 84.99 270 top
R5  10kΩ  [R0603]  25.15 64.17 270 top
R6  10kΩ  [R0603]  22.74 64.17 270 top
R8  51Ω  [R1206]  27.24 13.76 0 top
R9  150Ω  [R1210]  24.13 16.55 0 top
R10  348kΩ  [R0603]  3.17 59.22 270 top
R11  12kΩ  [R0603]  5.97 60.11 180 top
R12  430Ω  [R0603]  5.08 69.2 0 top
R13  470Ω  [R0603]  4.94 82.97 0 top
R14  510Ω  [R0603]  4.94 76.05 0 top
R16  1kΩ  [R0603]  21.84 19.59 180 top
R17  10kΩ  [R0603]  19.69 18.71 90 top
R19  1kΩ  [R0603]  54.75 12.09 270 top
R20  10kΩ  [R0603]  56.26 12.1 270 top
R21  120Ω  [R0603]  16.38 10.83 180 top
R26  10kΩ  [R0603]  15.66 16.69 270 top
R28  10kΩ  [R0603]  40.51 12.61 270 top
R29  1kΩ  [R0603]  38.99 12.61 270 top
SB1  Jumper  [PAD-JUMPER-2-NC_BY_PASTE_YES_SILK]  49.4 74.33 0 top
SETTING  TS-1187A-B-A-B  [SW-SMD_4P-L5.1-W5.1-P3.70-LS6.5-TL_H1.5]  41.25 74.88 90 top
START  TS-1187A-B-A-B  [SW-SMD_4P-L5.1-W5.1-P3.70-LS6.5-TL_H1.5]  41.25 83.77 90 top
STOP  TS-1187A-B-A-B  [SW-SMD_4P-L5.1-W5.1-P3.70-LS6.5-TL_H1.5]  41.25 66.05 90 top
U1  ESP32-S3-WROOM-1-N16R8  [WIRELM-SMD_ESP32-S3-WROOM-1]  26.54 79.03 0 top
U5  ADS1115IDGSR  [MSOP-10_L3.0-W3.0-P0.50-LS5.0-BL]  8.99 62.31 270 top
U6  AMS1117-3.3  [SOT-223-3_L6.5-W3.4-P2.30-LS7.0-BR]  27.03 57.8 0 top
U8  LMZM23601V5SILR  [USIP-10_L3.8-W3.0-TL_TI_SIL]  47.63 57.58 180 top
U10  DG301-5.0-02P-14-00A(H)  [CONN-TH_DEGSON_DG301-5.0-02P]  31.62 3.09 0 top
U12  TJA1051T/3/1J  [SOIC-8_L4.9-W3.9-P1.27-LS6.0-BL]  18.57 60.77 180 top
U16  CH343P  [TQFN-16_L3.0-W3.0-P0.50-BL-EP1.7]  49.9 82.1 180 top
USB1  TYPE-C16PIN  [USB-C-SMD_TYPE-C16PIN]  58.81 82.58 90 top
Y  -  [LED-TH_BD5.8-P2.54-FD]  10.13 83 180 top

## Footprints (pads in the part's own frame, mm; a bottom-side part is the same pattern mirrored in y, then rotated)
C0603
  rect 0.8x0.9 smd: 1(-0.7,0) 2(0.7,0)
C1206
  rect 1.485x1.728 smd: 1(-1.593,0) 2(1.593,0)
CONN-TH_2P-P3.50_DG381-3.5-02P-14-00A
  round 1.9 hole 1.3: 1(-1.75,0) 2(1.75,0)
CONN-TH_B2PS-VH-LF-SN
  rect 2.5x2.5 hole 1.8: 1(-1.98,0)
  round 2.5 hole 1.8: 2(1.98,0)
CONN-TH_DEGSON_DG301-5.0-02P
  round 2 hole 1.2: 1(-2.5,0) 2(2.5,0)
CONN-TH_S4B-XH-A-LF-SN
  rect 1.6x1.6 hole 1: 1(3.75,0)
  round 1.6 hole 1: 2(1.25,0) 3(-1.25,0) 4(-3.75,0)
HDR-TH_4P-P2.54-V-F
  rect 1.7x1.7 hole 1.1: 1(-3.81,0)
  round 1.7 hole 1.1: 2(-1.27,0) 3(1.27,0) 4(3.81,0)
LED-TH_BD5.8-P2.54-FD
  rect 1.6x1.6 hole 1: 1(-1.27,0)
  round 1.6 hole 1: 2(1.27,0)
MSOP-10_L3.0-W3.0-P0.50-LS5.0-BL
  oval 0.28x1.62 smd: 1(-1,-2.11) 2(-0.5,-2.11) 3(0,-2.11) 4(0.5,-2.11) 5(1,-2.11) 6(1,2.11) 7(0.5,2.11) 8(0,2.11) 9(-0.5,2.11) 10(-1,2.11)
PAD-JUMPER-2-NC_BY_PASTE_YES_SILK
  custom 1.156x0.914 smd: 1(-0.686,0)
  custom 1.105x0.914 smd: 2(0.584,0)
Pad_e125
  rect 3.048x1.524 hole 0.914: 1(0,0)
Pad_e128
  rect 3.048x1.524 hole 0.914: 1(0,0)
Pad_e146
  rect 3.048x1.524 hole 0.914: 1(0,0)
Pad_e150
  rect 3.048x1.524 hole 0.914: 1(0,0)
R0402
  rect 0.566x0.54 smd: 1(-0.433,0) 2(0.433,0)
R0603
  rect 0.806x0.864 smd: 1(-0.753,0) 2(0.753,0)
R1206
  rect 1.208x1.701 smd: 1(-1.479,0) 2(1.479,0)
R1210
  rect 1.282x2.808 smd: 1(-1.441,0) 2(1.441,0)
SMA_L4.2-W2.6-LS5.0-RD_1
  rect 1.52x1.68 smd: 1(-1.965,0) 2(1.965,0)
SMB_L4.6-W3.6-LS5.3-RD
  rect 2.047x2.192 smd: 1(-2.361,0) 2(2.361,0)
SOIC-8_L4.9-W3.9-P1.27-LS6.0-BL
  oval 0.588x2.045 smd: 1(-1.905,-2.772) 2(-0.635,-2.772) 3(0.635,-2.772) 4(1.905,-2.772) 5(1.905,2.772) 6(0.635,2.772) 7(-0.635,2.772) 8(-1.905,2.772)
SOT-23-3_L2.9-W1.3-P1.90-LS2.4-BR
  rect 1.25x0.7 smd: 1(1,-0.95) 2(1,0.95) 3(-1,0)
SOT-23_L2.9-W1.3-P1.90-LS2.4-BR
  rect 1x0.8 smd: 1(1.15,-0.95) 2(1.15,0.95) 3(-1.15,0)
SOT-223-3_L6.5-W3.4-P2.30-LS7.0-BR
  rect 2.5x1.1 smd: 1(2.97,-2.3) 2(2.97,0) 3(2.97,2.3)
  rect 2.34x3.6 smd: 4(-2.97,0)
SW-SMD_4P-L5.1-W5.1-P3.70-LS6.5-TL_H1.5
  rect 1x0.75 smd: 1(-3,1.875) 2(3,1.875) 3(-3,-1.875) 4(3,-1.875)
SW-SMD_L3.9-W3.0-P4.45
  rect 1.23x1.36 smd: 1(-2.185,0) 2(2.185,0)
TQFN-16_L3.0-W3.0-P0.50-BL-EP1.7
  rect 0.25x0.75 smd: 1(-0.749,-1.45) 2(-0.248,-1.45) 3(0.252,-1.45) 4(0.751,-1.45) 9(0.75,1.45) 10(0.25,1.45) 11(-0.25,1.45) 12(-0.749,1.45)
  rect 0.75x0.25 smd: 5(1.45,-0.75) 6(1.45,-0.25) 7(1.45,0.25) 8(1.45,0.75) 13(-1.45,0.75) 14(-1.45,0.25) 15(-1.45,-0.25) 16(-1.45,-0.75)
  rect 1.7x1.7 smd: 17(0.001,0)
USB-C-SMD_TYPE-C16PIN
  oval 1x2.1 hole 0.6x1.7: 1(-4.32,1.788) 2(4.32,1.788)
  oval 1x1.8 hole 0.6x1.4: 3(-4.32,-2.362) 4(4.32,-2.362)
  rect 0.6x1.15 smd: A1B12(-3.2,2.362) A4B9(-2.4,2.362) B1A12(3.2,2.362) B4A9(2.4,2.362)
  rect 0.3x1.15 smd: A5(-1.25,2.362) A6(-0.25,2.362) A7(0.25,2.362) A8(1.25,2.362) B5(1.75,2.362) B6(0.75,2.362) B7(-0.75,2.362) B8(-1.75,2.362)
USIP-10_L3.8-W3.0-TL_TI_SIL
  rect 0.75x0.4 smd: 1(-1.525,1.2) 2(-1.525,0.6) 3(-1.525,0) 4(-1.525,-0.6) 5(-1.525,-1.2) 6(1.525,-1.2) 7(1.525,-0.6) 8(1.525,0) 9(1.525,0.6) 10(1.525,1.2)
  rect 0.8x3 smd: 11(-0.175,0)
WIRELM-SMD_ESP32-S3-WROOM-1
  rect 1.5x0.9 smd: 1(-8.75,8.895) 2(-8.75,7.625) 3(-8.75,6.355) 4(-8.75,5.085) 5(-8.75,3.815) 6(-8.75,2.545) 7(-8.75,1.275) 8(-8.75,0.005) 9(-8.75,-1.265) 10(-8.75,-2.535) 11(-8.75,-3.805) 12(-8.75,-5.075) 13(-8.75,-6.345) 14(-8.75,-7.615) 27(8.75,-7.615) 28(8.75,-6.345) 29(8.75,-5.075) 30(8.75,-3.805) 31(8.75,-2.535) 32(8.75,-1.265) 33(8.75,0.005) 34(8.75,1.275) 35(8.75,2.545) 36(8.75,3.815) 37(8.75,5.085) 38(8.75,6.355) 39(8.75,7.625) 40(8.75,8.895)
  rect 0.9x1.5 smd: 15(-6.985,-8.895) 16(-5.715,-8.895) 17(-4.445,-8.895) 18(-3.175,-8.895) 19(-1.905,-8.895) 20(-0.635,-8.895) 21(0.635,-8.895) 22(1.905,-8.895) 23(3.175,-8.895) 24(4.445,-8.895) 25(5.715,-8.895) 26(6.985,-8.865)
  rect 0.9x0.9 smd: 41(-2.9,2.575) 41(-2.9,1.175) 41(-2.9,-0.225) 41(-1.5,2.575) 41(-1.5,1.175) 41(-1.5,-0.225) 41(-0.1,2.575) 41(-0.1,1.175) 41(-0.1,-0.225)

## Nets
As in the schematic, except:
12V: C17.2 CN3.1 CN5.1 CN6.1 D1.1 D4.1 NOREF#3.1 Q4.3 R26.2 U8.3 U8.4
120V: NOREF#2.1 R10.2 U10.1
GND: BOOT.2 C1.1 C2.1 C3.1 C4.2 C6.2 C7.2 C8.1 C9.2 C10.2 C11.1 C12.2 C13.2 C14.2 C15.2 C16.1 C17.1 C20.2 C24.1 C25.1 C26.1 C27.2 C28.1 C29.2 CN1.1 CN2.3 D3.2 EMERGENCY.3 EMERGENCY.4 EN.1 H1.1 NOREF.1 Q1.1 Q2.1 Q3.1 R2.1 R3.1 R8.2 R11.1 R12.1 R13.1 R14.1 R17.1 R20.1 R28.1 SETTING.3 SETTING.4 START.3 START.4 STOP.3 STOP.4 U1.1 U1.40 U1.41 U5.1 U5.3 U5.5 U5.7 U6.1 U8.1 U8.2 U8.11 U12.2 U12.8 U16.2 U16.17 USB1.1 USB1.2 USB1.3 USB1.4 USB1.A1B12 USB1.B1A12
GND_POWER_RETURN: NOREF#4.1 U10.2

Pads without a net: EMERGENCY 1; SETTING 1; STOP 1; U1 4 12 13 14 15 16 20 21 22 23 24 25 26 28 29 30 31 38 39; U5 2; U8 5 8 9 10; U16 10 11 14 15 16; USB1 A8 B8

## Via types
v1: diameter 0.61, hole 0.305, Top Layer to Bottom Layer, 93 vias

## Routing (per net, layer and track width the routed paths; a pad name or vN(x,y) marks a point on that pad's centre or on a via; arc(x,y) is an arc through that point)
5V: length 85.2
  Top Layer w0.254: v1(49.91,73.06) 49.91,74.26 SB1.2 ; C24.2 49.38,84.39 49.66,84.11 49.66,83.56 U16.3 ; U12.3 17.93,65.4 C29.1 17.91,65.51 v1(17.91,66.59)
  Top Layer w0.508: U6.3 27.94,62.16 27.94,66.84 27.81,66.97 ; v1(36.7,61.12) 36.71,61.11 36.71,60.07 ; v1(47.62,86.02) 48.52,86.02 48.76,85.78 48.79,85.78 C24.2
  Top Layer w0.762: U6.3 30.02,60.07 C9.1 38.26,60.07 39.17,59.16 C16.2 45.4,59.16 46.1,58.46
  Bottom Layer w0.254: 27.81,66.97 27.81,64.93 27.05,64.17 20.32,64.17 v1(17.91,66.59)
  Bottom Layer w0.508: v1(36.7,61.12) 40.89,65.32 43.94,65.32 44.3,65.67 44.3,72.92 ; v1(47.62,86.02) 45.59,86.02 44.3,84.72 44.3,72.92 ; 44.3,72.92 49.77,72.92 v1(49.91,73.06)
12V: length 147.8
  Top Layer w0.762: 49.15,57.82 50.35,57.82 C17.2 ; R26.2 14.88,15.16 Q4.3 12.57,14.4 12.57,8.04 13.72,6.9 23.75,6.9 25.4,8.55 34.54,8.55 36.18,6.91 39.27,6.91
  Top Layer w1.27: C17.2 51.76,59.09 58.17,59.09 61.59,55.66 NOREF#3.1 ; CN6.1 39.27,9.35 D4.1 ; CN3.1 55.02,8.71 D1.1
  Bottom Layer w1.27: CN5.1 49.18,5.37 53.11,5.37 CN3.1 ; CN5.1 47.27,32.07 51.31,36.11 61.59,36.11 NOREF#3.1 ; CN5.1 45.37,5.37 40.89,5.37 39.27,3.75 CN6.1
120V: length 86.5
  Top Layer w0.254: v1(3.17,57.31) R10.2
  Bottom Layer w0.254: NOREF#2.1 2.66,56.8 v1(3.17,57.31)
  Bottom Layer w1.27: NOREF#2.1 2.91,35.86 6.09,35.86 6.98,34.96 6.98,31.03 1.91,25.95 1.91,6.64 5.46,3.09 U10.1
GND:
  vias: v1(3.05,82.97) v1(3.05,75.98) v1(3.05,69.13) v1(3.58,18.58) v1(5.08,64.68) v1(7.67,59.98) v1(8.25,87.54) v1(13.21,59.98) v1(15.15,61.08) v1(18.24,16.86) v1(19.18,66.59) v1(19.3,87.92) v1(19.69,16.86) v1(20.45,56.43) v1(21.47,65.7) v1(22.48,81.57) v1(22.48,80.17) v1(22.48,78.78) v1(23.62,82.84) v1(23.62,77.51) v1(25.02,82.84) v1(25.05,77.51) v1(26.29,82.84) v1(26.54,77.51) v1(26.92,60.49) v1(27.69,81.57) v1(27.69,80.3) v1(27.69,78.82) v1(30.1,54.27) v1(30.48,13.75) v1(33.15,52.97) v1(34.04,87.92) v1(36.96,75.48) v1(36.96,73.83) v1(36.96,72.05) v1(37.97,80.56) v1(40.51,14.64) v1(42.04,14.64) v1(43.05,87.92) v1(43.18,79.29) v1(43.18,70.52) v1(43.94,54.39) v1(44.12,63.05) v1(45.34,69) v1(45.97,55.41) v1(46.23,79.41) v1(46.23,77.8) v1(46.37,59.73) v1(47.8,59.68) v1(47.8,55.45) v1(49.28,55.41) v1(49.4,59.73) v1(49.9,82.1) v1(51.69,54.39) v1(52.2,84.11) v1(53.21,63.16) v1(54.23,79.92) v1(55.25,86.54) v1(56.26,14.13) v1(57.69,14.13) v1(61.62,76.64) v1(61.59,68.11) v1(62.92,74.08) v1(62.87,70.65)
GND_POWER_RETURN: length 62.1
  Top Layer w1.27: NOREF#4.1 3.33,31.44 3.33,27.56 1.97,26.2 1.97,6.58 5.46,3.09 25.02,3.09 27.56,5.62 31.58,5.62 U10.2
VBUS: length 24.2
  Top Layer w0.254: U16.9 49.15,79.67 C26.2 48.91,79.44 C27.1 48.91,76.38 v1(48.77,76.24) 48.77,74.38 SB1.1 ; USB1.A4B9 57.15,80.18 57.66,80.68 v1(57.66,81.43) 57.66,84.48 57.14,84.99 56.46,84.99 USB1.B4A9
  Bottom Layer w0.254: v1(57.66,81.43) 52.47,76.24 v1(48.77,76.24)
VDD33: length 121.3
  Top Layer w0.254: U1.2 17.48,86.97 C3.2 ; C25.2 51.15,84.71 50.65,84.21 U16.1 ; U5.8 12.42,62.31 C20.1
  Top Layer w0.508: v1(34.93,57.95) 34.7,57.72 C10.1 ; R1.1 14.48,85.37 v1(14.48,86.78) ; 14.22,62.39 v1(14.22,63.98) ; 14.22,62.39 13.73,62.89 C20.1 ; 14.22,62.39 14.22,59.34 14.3,59.27 14.3,59.25 14.53,59.01 14.56,59.01 C28.2 16.25,58.41 U12.5 16.79,58.12 16.79,59.5 17.15,59.85 22,59.85 U6.4 ; C1.2 13.66,86.78 v1(14.48,86.78) ; v1(52.37,85.85) 51.67,85.15 C25.2 ; v1(14.48,86.78) 15.69,86.78 C3.2
  Top Layer w0.762: R5.2 25.15,58.88 U6.4 24.06,58.65 22.73,59.98 22.73,63.4 22.74,63.41
  Top Layer w1.016: U6.4 U6.2 33.08,57.8 C10.1
  Bottom Layer w0.508: v1(34.93,57.95) 35.94,58.97 35.94,64.43 39.12,67.6 41.28,67.6 42.04,68.36 42.04,84.49 45.15,87.6 51.33,87.6 52.37,86.56 v1(52.37,85.85) ; v1(14.48,86.78) 13.84,86.14 13.84,64.36 v1(14.22,63.98)
CANH: length 50.4
  Top Layer w0.254: v1(19.2,56.43) 19.2,57.99 U12.7 ; v1(17.21,12.1) 17.14,12.03 R21.1 17.14,9.76 17.55,9.35 CN2.2
  Bottom Layer w0.254: v1(17.21,12.1) 16.56,12.76 16.56,46.06 18.72,48.23 18.72,55.95 v1(19.2,56.43)
CANL: length 50.5
  Top Layer w0.254: v1(15.49,12.1) 15.63,11.97 R21.2 15.63,9.93 15.05,9.35 CN2.1 ; U12.6 17.91,57.97 v1(17.91,56.43)
  Bottom Layer w0.254: v1(15.49,12.1) 16.15,12.76 16.15,46.22 18.32,48.39 18.32,56.01 v1(17.91,56.43)
COUPLER: length 9.7
  Top Layer w0.762: Q3.3 44.05,10.38 D4.2 43.11,3.81 CN6.2
CP: length 7.4
  Top Layer w0.762: R9.1 22.55,16.4 CN2.4
DC_RELAY: length 20.7
  Top Layer w0.762: CN3.2 58.52,2.01 57.66,1.15 51.31,1.15 50.77,1.69 CN5.2
  Top Layer w1.016: Q1.3 59.67,9.87 D1.2 58.52,8.72 CN3.2
EN: length 68.2
  Top Layer w0.254: C5.1 52.23,79.23 EN.2 58.86,75.56 C4.1 58.86,87.61 57.66,88.81 22.48,88.81 19.06,85.39 U1.3 17.66,85.25 R1.2 15.81,85.2 C2.2
IO0: length 42.3
  Top Layer w0.254: BOOT.1 55.99,70.67 51.51,75.15 51.51,81.19 U16.13 ; BOOT.1 54.09,67.47 38.86,67.47 35.29,71.04 U1.27 ; BOOT.1 58.77,69.18 C11.2
IO5: length 6.5
  Top Layer w0.254: U1.5 11.56,82.85 Y.1
IO6: length 9.5
  Top Layer w0.254: 11.42,76.02 11.42,77.37 15.63,81.58 U1.6
IO7: length 14.9
  Top Layer w0.254: U1.7 15.75,80.31 13.46,78.02 13.46,71.07 R.1
IO9: length 63.9
  Top Layer w0.254: v1(22.73,20.74) 22.73,19.73 R16.1 ; v1(32,65.19) 32,67.86 31.62,68.24 22.48,68.24 22.1,68.62 U1.17
  Bottom Layer w0.254: v1(32,65.19) 32,57.7 22.73,48.42 v1(22.73,20.74)
IO10: length 67.5
  Top Layer w0.254: U1.18 23.37,69.81 24.59,68.59 31.77,68.59 32.77,67.6 32.77,65.22 v1(32.8,65.19) ; v1(38.99,16.55) R29.1
  Bottom Layer w0.254: v1(32.8,65.19) 32.8,57.51 38.99,51.32 v1(38.99,16.55)
IO11: length 77.5
  Top Layer w0.254: v1(33.61,65.19) 33.53,65.27 33.53,67.34 31.92,68.95 25.5,68.95 24.64,69.81 U1.19 ; R19.1 50.66,16.93 v1(44.52,16.93)
  Bottom Layer w0.254: v1(33.61,65.19) 33.38,64.96 33.38,64.95 33.15,64.72 33.15,58.83 39.95,52.04 39.95,21.5 v1(44.52,16.93)
IO17: length 14.3
  Top Layer w0.254: U1.10 18.33,75.96 18.66,75.96 18.82,75.79 18.82,70.85 18.8,70.82 18.8,68.36 20.47,66.68 U12.1
IO18: length 12.4
  Top Layer w0.254: U12.4 16.64,63.57 16.64,74.39 16.93,74.69 17.25,74.69 U1.11
IO39: length 13.5
  Top Layer w0.254: C12.1 40.42,70.1 STOP.2 38.69,69.05 38.1,69.63 38.1,76.49 36.82,77.77 U1.32
IO40: length 19
  Top Layer w0.254: U1.33 36.82,79.04 41.78,74.08 43.31,74.08 48.34,69.05 EMERGENCY.2 49.49,70.2 C14.1
IO41: length 6.9
  Top Layer w0.254: C15.1 40.48,78.99 SETTING.2 36.94,80.31 U1.34
IO42: length 4.4
  Top Layer w0.254: U1.35 38.56,81.58 START.1
RXD0: length 14.6
  Top Layer w0.254: U1.36 35.3,82.84 42.29,82.84 43.56,84.11 48.58,84.11 U16.4
SCL: length 32.9
  Top Layer w0.254: U1.8 16.26,79.04 14.73,77.51 v1(14.73,69.17) 14.73,67.73 11.1,64.09 U5.10
  Top Layer w0.762: H1.3 25.15,66.84 R5.1
  Bottom Layer w0.254: H1.3 23.07,69.17 v1(14.73,69.17)
SDA: length 29.2
  Top Layer w0.254: U1.9 17.67,77.89 16.51,77.89 15.32,76.69 v1(15.32,68.32) 15.32,67.55 12.19,64.43 12.19,63.03 11.98,62.81 U5.9
  Top Layer w0.762: H1.4 22.74,66.96 R6.1
  Bottom Layer w0.254: H1.4 21.38,68.32 v1(15.32,68.32)
TXD0: length 15.2
  Top Layer w0.254: v1(47.88,84.87) 47.47,84.47 43.41,84.47 43.06,84.12 U1.37 ; U16.5 47.88,83.42 v1(47.88,83.48)
  Bottom Layer w0.254: v1(47.88,83.48) v1(47.88,84.87)
UD+: length 13.5
  Top Layer w0.254: 48.19,81.75 48.18,81.75 47.96,81.75 47.56,81.35 v1(47.38,81.35) ; v1(54.99,83.35) 55.01,83.33 USB1.B6 56.52,83.26 57.14,83.26 57.3,83.09 57.3,82.56 57.05,82.3 56.47,82.3 USB1.A6
  Bottom Layer w0.254: v1(47.38,81.35) 47.94,81.35 48.09,81.2 51.86,81.2 53.76,83.1 54.18,83.1 54.43,83.35 v1(54.99,83.35)
UD-: length 13.5
  Top Layer w0.254: v1(54.99,82.35) 55.09,82.46 55.59,82.46 ; 48.35,81.34 47.81,80.8 47.75,80.8 47.6,80.65 v1(47.09,80.65) ; 55.59,82.46 55.59,82.68 55.74,82.83 USB1.A7 ; 55.59,82.46 55.59,82.06 55.76,81.9 56.38,81.9 USB1.B7
  Bottom Layer w0.254: v1(47.09,80.65) 47.65,80.65 47.8,80.8 52.03,80.8 53.88,82.65 54.14,82.65 54.43,82.35 v1(54.99,82.35)
VP: length 6.7
  Top Layer w0.762: D3.1 11.27,18.58 Q4.2
  Top Layer w1.27: D3.1 10,15.3 CN1.2
$1N24268: length 3.2
  Top Layer w0.254: R13.2 5.73,83 8.86,83
$1N24269: length 3.2
  Top Layer w0.254: R14.2 5.73,76.02 G.2
$1N24273: length 3.2
  Top Layer w0.254: R.2 8.97,69.2 R12.2
$1N24295: length 1.4
  Top Layer w0.254: USB1.A5 56.38,81.26 55.76,81.26 55.35,80.85 R2.2
$1N24313: length 53.8
  Top Layer w0.254: U5.6 11.1,60.1 C7.1
  Top Layer w0.762: C7.1 10.92,59.88 10.92,38.52 25.57,23.87 R9.2 25.76,16.35 R8.1
$1N24345: length 5.8
  Top Layer w0.254: C8.2 5.98,61.95 6.03,61.89 6.8,61.89 U5.4
  Top Layer w0.762: 3.13,59.98 5.09,59.98 R11.2 5.22,61.86 C8.2
$1N24347: length 2.9
  Top Layer w0.762: Q2.3 16.27,18.06 R26.1 15.64,17.46 Q4.1
$1N24383: length 1.8
  Top Layer w0.254: START.2 40.44,87.84 C13.1
$1N24441: length 2.9
  Top Layer w0.762: R16.2 20.96,19.46 R17.2 19.51,19.63 Q2.2
$1N24443: length 1.3
  Top Layer w0.254: USB1.B5 56.38,84.4 55.76,84.4 55.6,84.56 55.25,84.56
$1N24451: length 1.4
  Top Layer w0.254: U16.12 50.83,80.47 C5.2
$1N24463: length 1.3
  Top Layer w0.254: U16.6 48.43,82.36 C6.1
$3N445: length 3
  Top Layer w0.254: Q1.2 57.48,11.35 R20.2 56.25,11.34 R19.2
$3N451: length 3.1
  Top Layer w0.254: Q3.2 41.86,11.86 R28.2 R29.2

## Copper pours and planes (outline as drawn; the poured copper is in the pictures)
GND on Top Layer: 0,89.32 64.13,89.32 64.13,0 0,0
GND on Bottom Layer: 0,89.32 64.13,89.32 64.13,0 0,0

Small or netless copper shapes (teardrops, artwork), in the pictures only: 206 on Top Layer, 39 on Bottom Layer

## Text on the board
Top Silkscreen Layer: TES SECC V1.0 | Chris Huang | 2025 | GD | VP | Coupler | + - | DC Relay | D- | D+ | GND | CP | 120V | DC120V-DC12V Buck
